# EAGLE design writer2 (EAGLE 6.6.0)
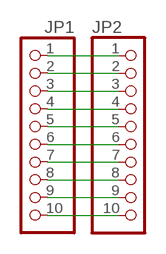
[diagram p0: schematic, sheet 1]

## Parts
JP1  PINHD-1X10  [1X10]
JP2  PINHD-1X10  [1X10]

## Nets
N$1: JP1.10 JP2.10
N$2: JP1.9 JP2.9
N$3: JP1.8 JP2.8
N$4: JP1.7 JP2.7
N$5: JP1.6 JP2.6
N$6: JP1.5 JP2.5
N$7: JP1.4 JP2.4
N$8: JP1.3 JP2.3
N$9: JP1.2 JP2.2
N$10: JP1.1 JP2.1

## Library data of the parts
JP1 JP2 = pinhead:PINHD-1X10: PIN HEADER

## Board
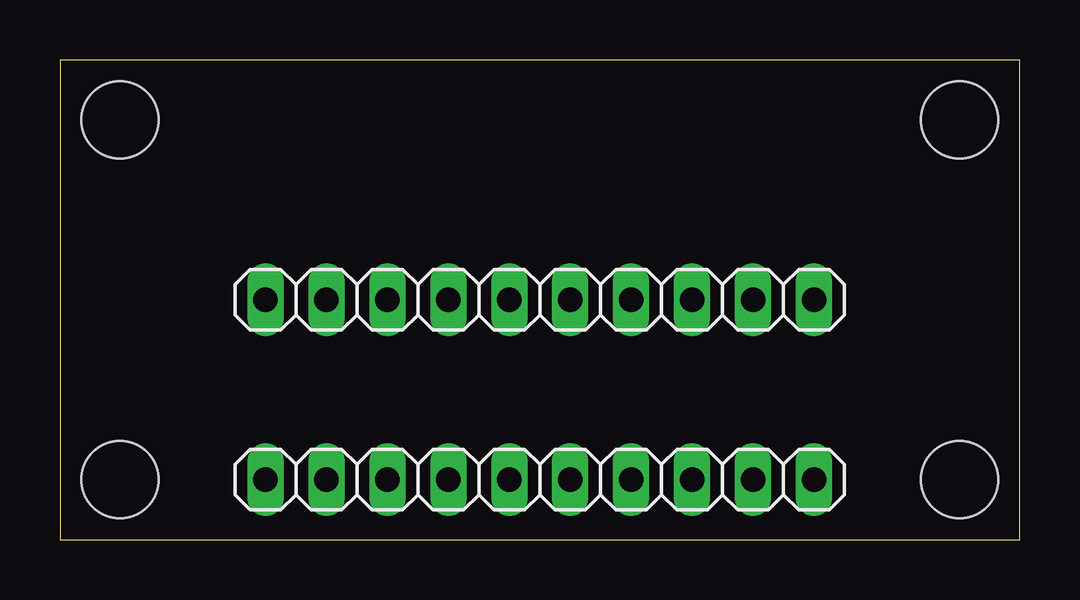
[diagram p1: board, top side]
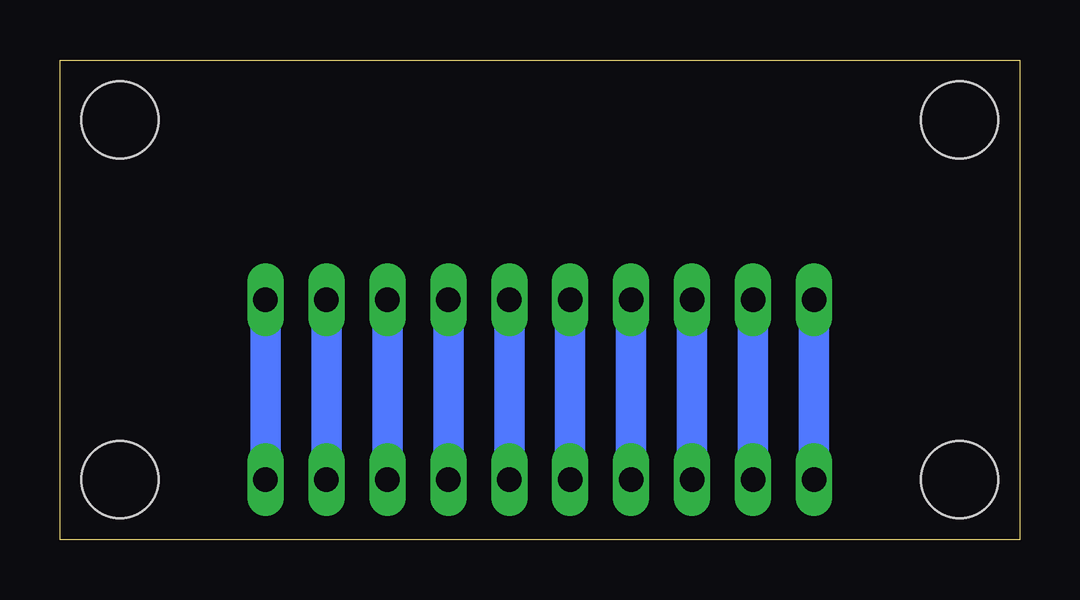
[diagram p2: board, bottom side, seen from below]

Size 40 x 20 mm. Coordinates in mm from the lower left corner, seen from the top.
Outline: 0,0 40,0 40,20 0,20 0,0
Copper layers (1*16): Top 0.035mm / dielectric 1.5mm / Bottom 0.035mm
Design rules "SeeedStudio_2layer_DRU_no_angle_20140221": minimum track width 6mil, minimum drill 12mil, track to track 6mil, track to pad 6mil, pad to pad 6mil, via to via 6mil, smd to smd 0mil, copper to edge 10mil, drill to drill 10mil, minimum pad ring 10mil, minimum via ring 6mil, stop-mask expansion 2mil, vias tented up to drill 100mil, thermal gap 10mil
Holes 3.2 mm at 2.5,17.5 37.5,17.5 37.5,2.5 2.5,2.5

### Footprints (pad centres in the part's own frame; a part is rotated, then mirrored left to right if it is on the bottom)
1X10 = drill 1.016 long: 1 -11.43,0; 2 -8.89,0; 3 -6.35,0; 4 -3.81,0; 5 -1.27,0; 6 1.27,0; 7 3.81,0; 8 6.35,0; 9 8.89,0; 10 11.43,0

### Placement (x,y rotation side)
JP1  20,10 0 top
JP2  20,2.5 0 top

### Tracks (layer width: path | path; a pad name or v marks a point on that pad's centre or on a via)
N$1
  Bottom 1.27: JP1.10 JP2.10
N$2
  Bottom 1.27: JP1.9 JP2.9
N$3
  Bottom 1.27: JP1.8 JP2.8
N$4
  Bottom 1.27: JP1.7 JP2.7
N$5
  Bottom 1.27: JP1.6 JP2.6
N$6
  Bottom 1.27: JP1.5 JP2.5
N$7
  Bottom 1.27: JP1.4 JP2.4
N$8
  Bottom 1.27: JP1.3 JP2.3
N$9
  Bottom 1.27: JP1.2 JP2.2
N$10
  Bottom 1.27: JP1.1 JP2.1

### Text on the board
tDocu: 20 x 40 mm